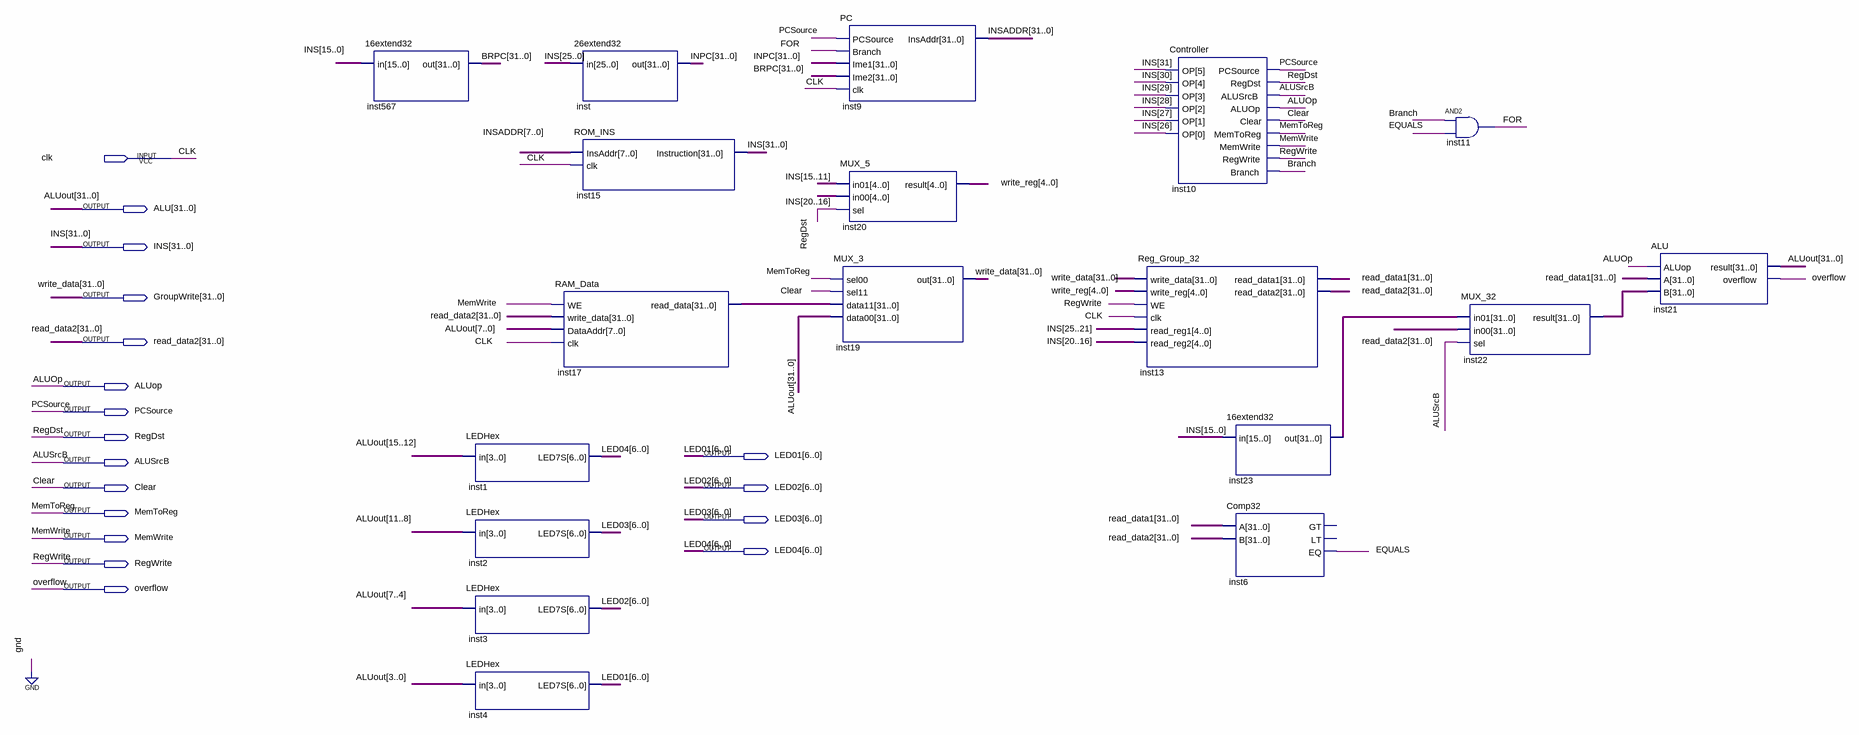
[diagram p0: schematic sheet]
// Quartus schematic CPU.bdf as structural Verilog: 18 symbols, 18 pins
module CPU (
  input  clk,
  output [31:0] ALU,
  output [31:0] INS,
  output [31:0] GroupWrite,
  output [31:0] read_data2,
  output ALUop,
  output PCSource,
  output RegDst,
  output [6:0] LED01,
  output ALUSrcB,
  output Clear,
  output [6:0] LED02,
  output MemToReg,
  output [6:0] LED03,
  output MemWrite,
  output [6:0] LED04,
  output RegWrite,
  output overflow
);

  wire Branch, EQUALS, FOR;
  wire [4:0] write_reg;
  wire [31:0] BRPC, INPC, INSADDR, inst17_read_data, inst22_result, inst23_out, read_data1;

  \16extend32  inst567 (.in(INS[15:0]), .out(BRPC));
  LEDHex inst1 (.in(ALU[15:12]), .LED7S(LED04));
  LEDHex inst2 (.in(ALU[11:8]), .LED7S(LED03));
  LEDHex inst3 (.in(ALU[7:4]), .LED7S(LED02));
  LEDHex inst4 (.in(ALU[3:0]), .LED7S(LED01));
  \26extend32  inst (.in(INS[25:0]), .out(INPC));
  ROM_INS inst15 (.InsAddr(INSADDR[7:0]), .clk(clk), .Instruction(INS));
  RAM_Data inst17 (
    .WE(MemWrite), .write_data(read_data2), .DataAddr(ALU[7:0]), .clk(clk), .read_data(inst17_read_data));
  MUX_3 inst19 (.sel00(MemToReg), .sel11(Clear), .data11(inst17_read_data), .data00(ALU), .out(GroupWrite));
  PC inst9 (.PCSource(PCSource), .Branch(FOR), .Ime1(INPC), .Ime2(BRPC), .clk(clk), .InsAddr(INSADDR));
  MUX_5 inst20 (.in01(INS[15:11]), .in00(INS[20:16]), .sel(RegDst), .result(write_reg));
  Reg_Group_32 inst13 (
    .write_data(GroupWrite), .write_reg(write_reg), .WE(RegWrite), .clk(clk), .read_reg1(INS[25:21]),
    .read_reg2(INS[20:16]), .read_data1(read_data1), .read_data2(read_data2));
  Controller inst10 (
    .OP(INS[31:26]), .PCSource(PCSource), .RegDst(RegDst), .ALUSrcB(ALUSrcB), .ALUOp(ALUop), .Clear(Clear),
    .MemToReg(MemToReg), .MemWrite(MemWrite), .RegWrite(RegWrite), .Branch(Branch));
  \16extend32  inst23 (.in(INS[15:0]), .out(inst23_out));
  Comp32 inst6 (.A(read_data1), .B(read_data2), .EQ(EQUALS));  // open: GT, LT
  and inst11 (FOR, Branch, EQUALS);
  MUX_32 inst22 (.in01(inst23_out), .in00(read_data2), .sel(ALUSrcB), .result(inst22_result));
  ALU inst21 (.ALUop(ALUop), .A(read_data1), .B(inst22_result), .result(ALU), .overflow(overflow));

  // Other names for the same wires on the sheet: ALUout[31:0] = ALU; write_data[31:0] = GroupWrite
endmodule
